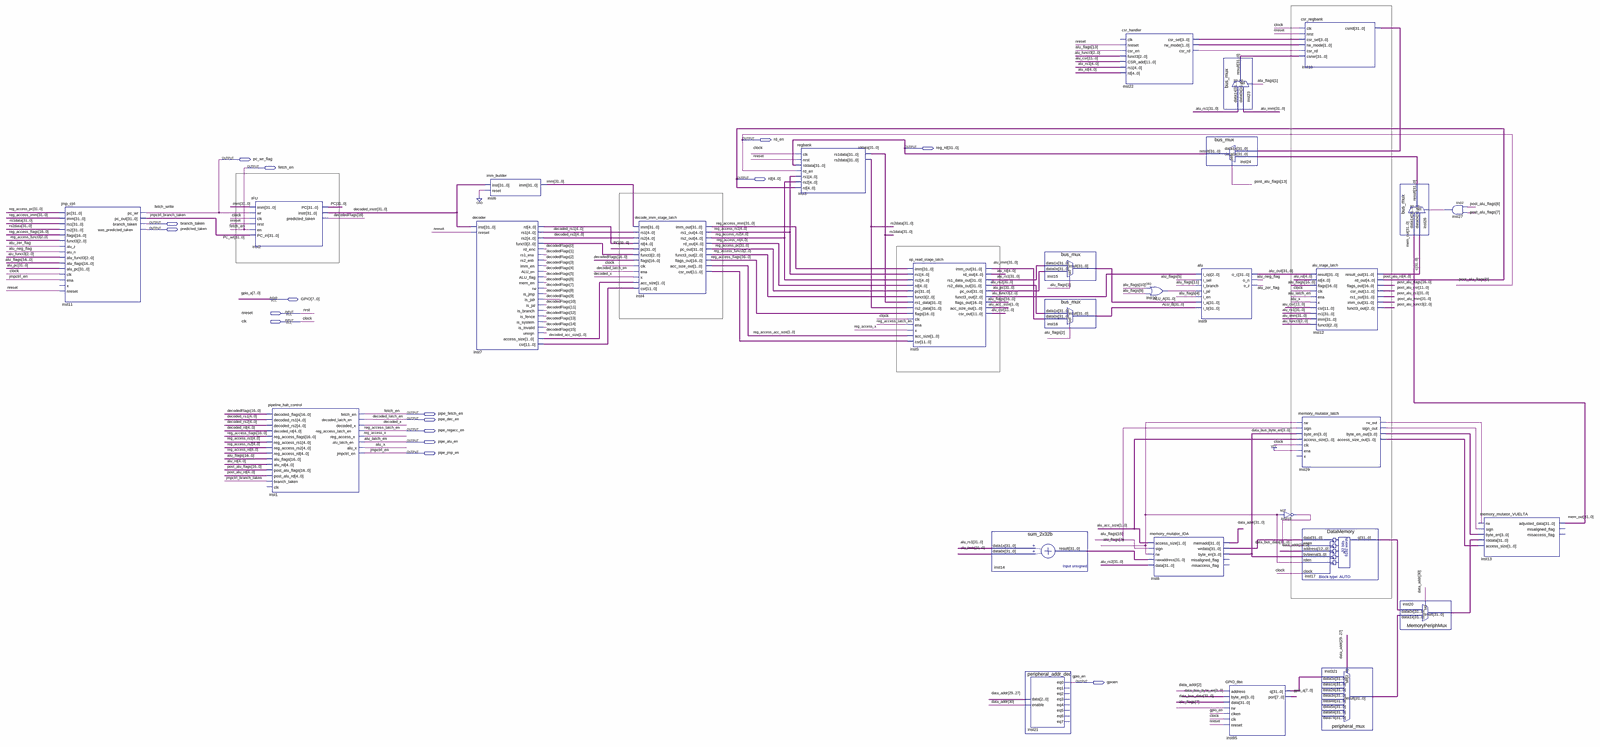
[diagram p0: schematic sheet, whole]
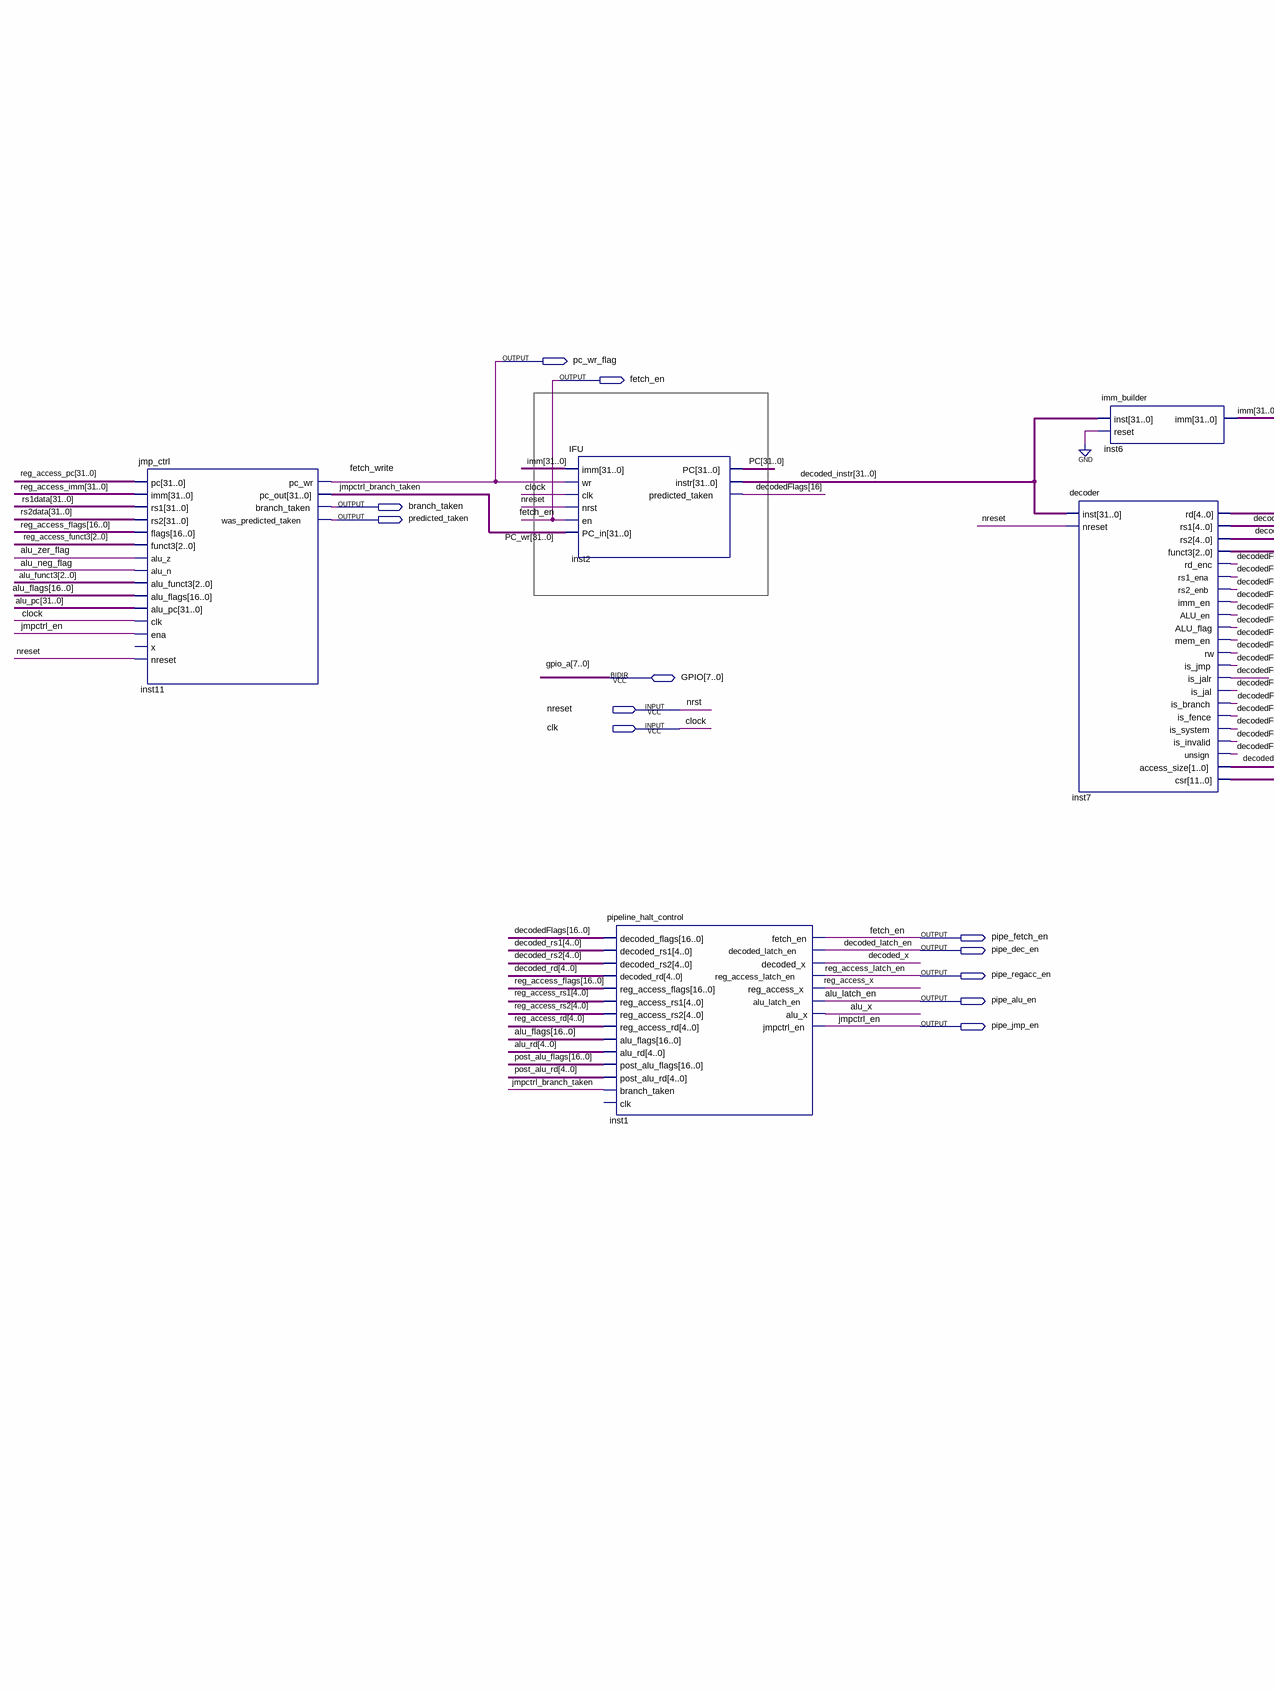
[diagram p1: schematic sheet, left part]
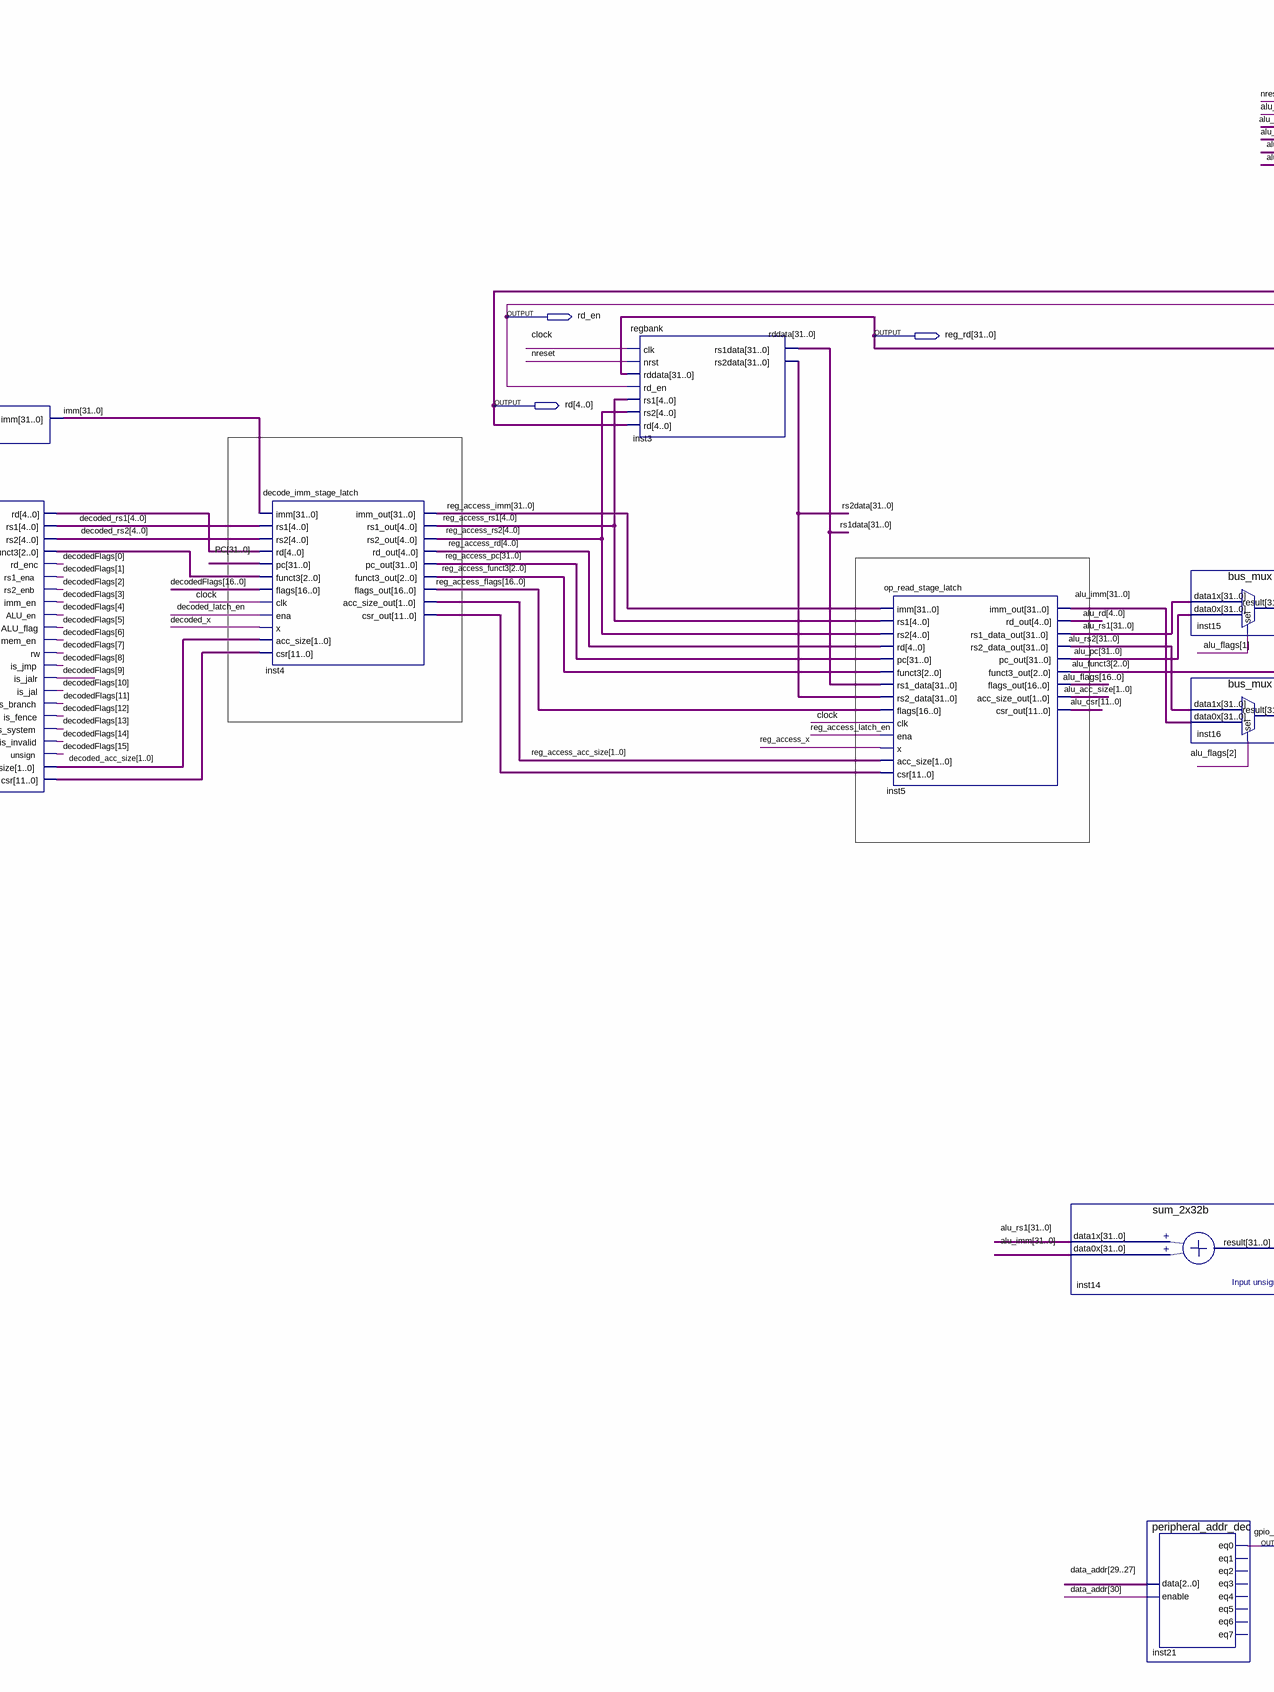
[diagram p2: schematic sheet, centre part]
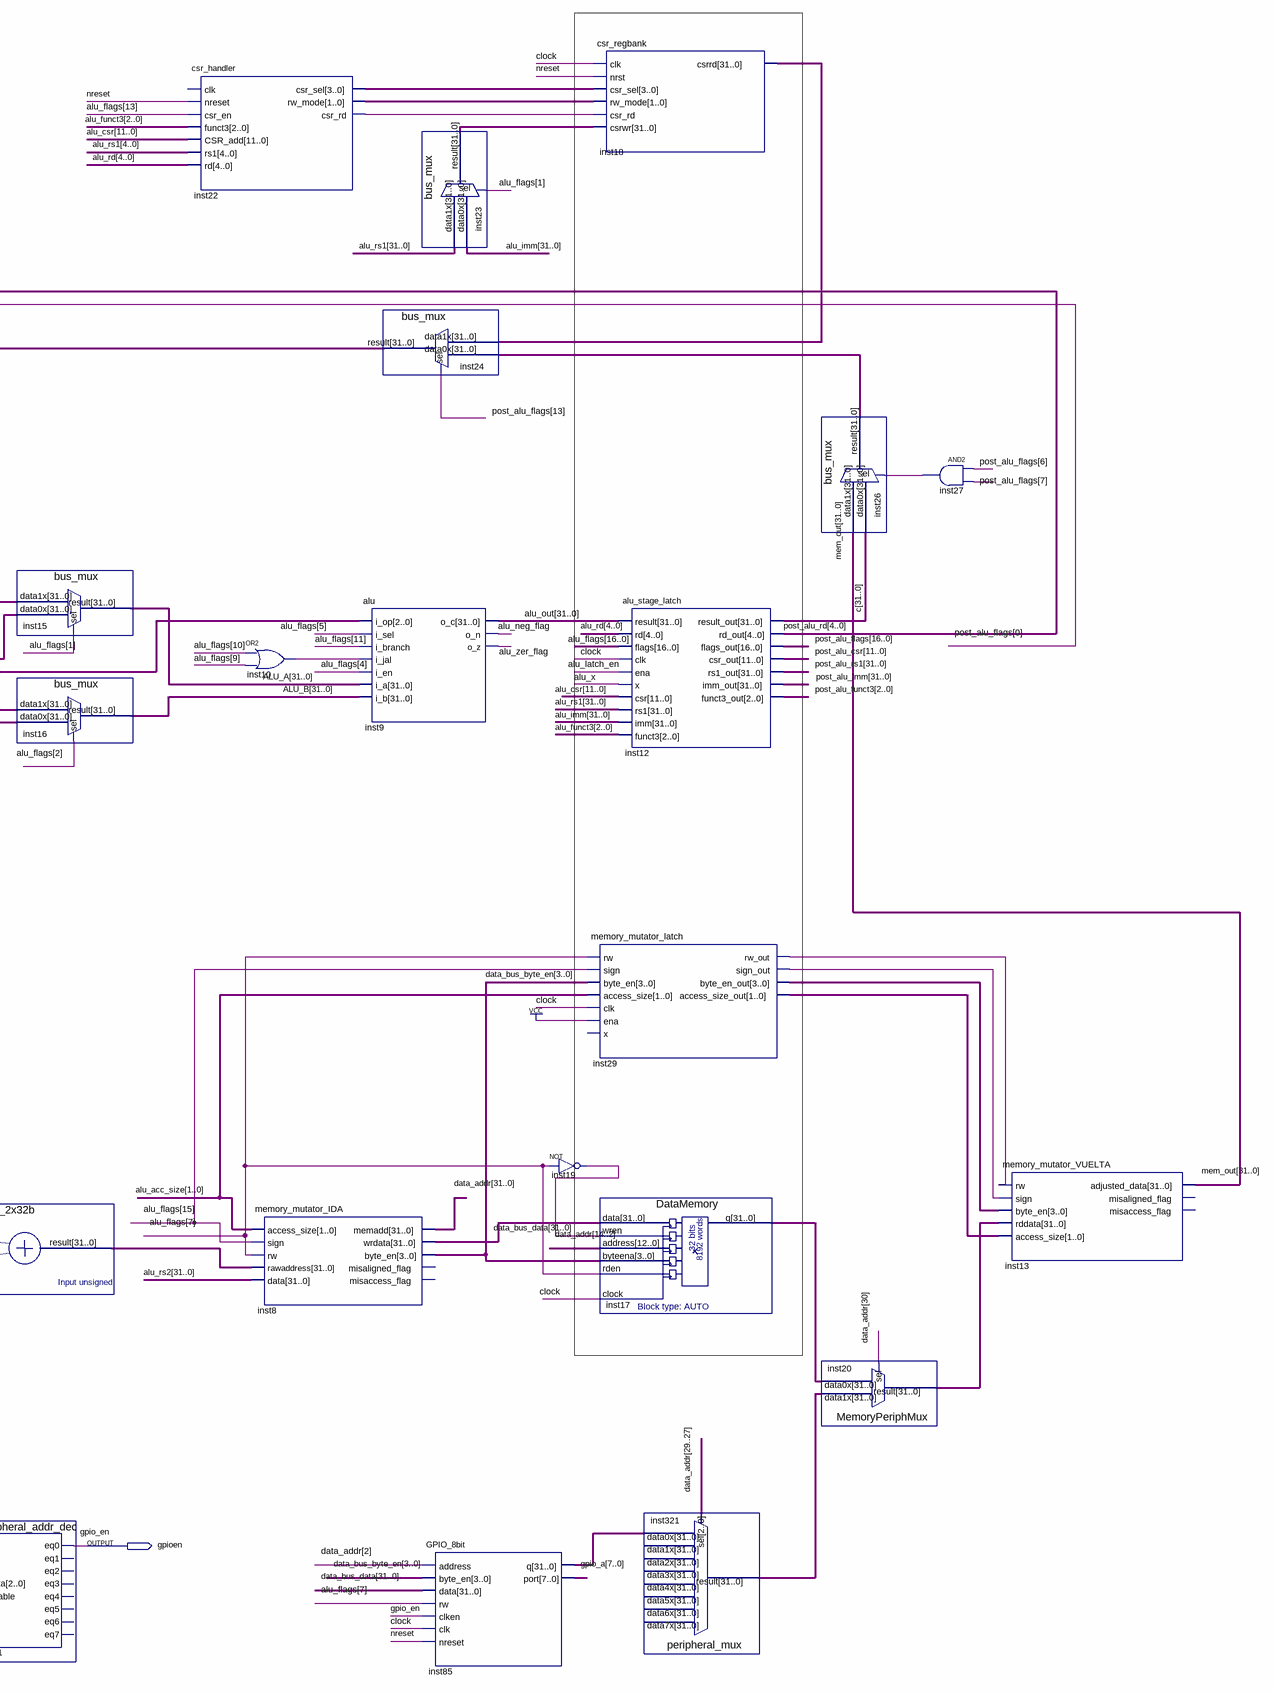
[diagram p3: schematic sheet, right part]
// Quartus schematic ERV24.bdf as structural Verilog: 29 symbols, 16 pins
module ERV24 (
  input  nreset,
  input  clk,
  inout  [7:0] GPIO,
  output rd_en,
  output [31:0] reg_rd,
  output pc_wr_flag,
  output fetch_en,
  output [4:0] rd,
  output branch_taken,
  output predicted_taken,
  output pipe_fetch_en,
  output pipe_dec_en,
  output pipe_regacc_en,
  output pipe_alu_en,
  output pipe_jmp_en,
  output gpioen
);

  wire alu_neg_flag, alu_x, alu_zer_flag, decoded_x, inst10_out, inst19_out, inst22_csr_rd, inst27_out,
       inst29_rw_out, inst29_sign_out, reg_access_x;
  wire [1:0] alu_acc_size, decoded_acc_size, inst22_rw_mode, inst29_access_size_out, reg_access_acc_size;
  wire [2:0] alu_funct3, inst7_funct3, post_alu_funct3, reg_access_funct3;
  wire [3:0] data_bus_byte_en, inst22_csr_sel, inst29_byte_en_out;
  wire [4:0] alu_rd, decoded_rd, decoded_rs1, decoded_rs2, inst7_rd, reg_access_rd, reg_access_rs1,
       reg_access_rs2;
  wire [11:0] alu_csr, inst4_csr_out, inst7_csr, post_alu_csr;
  wire [16:0] alu_flags, decodedFlags, reg_access_flags;
  wire [16:1] post_alu_flags;
  wire [31:0] ALU_A, ALU_B, alu_imm, alu_out, alu_pc, alu_rs1, alu_rs2, c, data_addr, data_bus_data,
       decoded_instr, imm, inst14_result, inst17_q, inst18_csrrd, inst20_result, inst23_result,
       inst26_result, inst85_q, inst321_result, mem_out, PC, PC_wr, post_alu_imm, post_alu_rs1,
       reg_access_imm, reg_access_pc, rs1data, rs2data;

  jmp_ctrl inst11 (
    .pc(reg_access_pc), .imm(reg_access_imm), .rs1(rs1data), .rs2(rs2data), .flags(reg_access_flags),
    .funct3(reg_access_funct3), .alu_z(alu_zer_flag), .alu_n(alu_neg_flag), .alu_funct3(alu_funct3),
    .alu_flags(alu_flags), .alu_pc(alu_pc), .clk(clk), .ena(pipe_jmp_en), .nreset(nreset),
    .pc_wr(pc_wr_flag), .pc_out(PC_wr), .branch_taken(branch_taken), .was_predicted_taken(predicted_taken));  // open: x
  IFU inst2 (
    .imm(imm), .wr(pc_wr_flag), .clk(clk), .nrst(nreset), .en(fetch_en), .PC_in(PC_wr), .PC(PC),
    .instr(decoded_instr), .predicted_taken(decodedFlags[16]));
  pipeline_halt_control inst1 (
    .decoded_flags(decodedFlags), .decoded_rs1(decoded_rs1), .decoded_rs2(decoded_rs2),
    .decoded_rd(decoded_rd), .reg_access_flags(reg_access_flags), .reg_access_rs1(reg_access_rs1),
    .reg_access_rs2(reg_access_rs2), .reg_access_rd(reg_access_rd), .alu_flags(alu_flags), .alu_rd(alu_rd),
    .post_alu_flags({post_alu_flags, rd_en}), .post_alu_rd(rd), .branch_taken(branch_taken),
    .fetch_en(fetch_en), .decoded_latch_en(pipe_dec_en), .decoded_x(decoded_x),
    .reg_access_latch_en(pipe_regacc_en), .reg_access_x(reg_access_x), .alu_latch_en(pipe_alu_en),
    .alu_x(alu_x), .jmpctrl_en(pipe_jmp_en));  // open: clk
  decoder inst7 (
    .inst(decoded_instr), .nreset(nreset), .rd(inst7_rd), .rs1(decoded_rs1), .rs2(decoded_rs2),
    .funct3(inst7_funct3), .rd_enc(decodedFlags[0]), .rs1_ena(decodedFlags[1]), .rs2_enb(decodedFlags[2]),
    .imm_en(decodedFlags[3]), .ALU_en(decodedFlags[4]), .ALU_flag(decodedFlags[5]), .mem_en(decodedFlags[6]),
    .rw(decodedFlags[7]), .is_jmp(decodedFlags[8]), .is_jalr(decodedFlags[9]), .is_jal(decodedFlags[10]),
    .is_branch(decodedFlags[11]), .is_fence(decodedFlags[12]), .is_system(decodedFlags[13]),
    .is_invalid(decodedFlags[14]), .unsign(decodedFlags[15]), .access_size(decoded_acc_size), .csr(inst7_csr));
  imm_builder inst6 (.inst(decoded_instr), .reset(1'b0), .imm(imm));
  decode_imm_stage_latch inst4 (
    .imm(imm), .rs1(decoded_rs1), .rs2(decoded_rs2), .rd(inst7_rd), .pc(PC), .funct3(inst7_funct3),
    .flags(decodedFlags), .clk(clk), .ena(pipe_dec_en), .x(decoded_x), .acc_size(decoded_acc_size),
    .csr(inst7_csr), .imm_out(reg_access_imm), .rs1_out(reg_access_rs1), .rs2_out(reg_access_rs2),
    .rd_out(reg_access_rd), .pc_out(reg_access_pc), .funct3_out(reg_access_funct3),
    .flags_out(reg_access_flags), .acc_size_out(reg_access_acc_size), .csr_out(inst4_csr_out));
  regbank inst3 (
    .clk(clk), .nrst(nreset), .rddata(reg_rd), .rd_en(rd_en), .rs1(reg_access_rs1), .rs2(reg_access_rs2),
    .rd(rd), .rs1data(rs1data), .rs2data(rs2data));
  op_read_stage_latch inst5 (
    .imm(reg_access_imm), .rs1(reg_access_rs1), .rs2(reg_access_rs2), .rd(reg_access_rd), .pc(reg_access_pc),
    .funct3(reg_access_funct3), .rs1_data(rs1data), .rs2_data(rs2data), .flags(reg_access_flags), .clk(clk),
    .ena(pipe_regacc_en), .x(reg_access_x), .acc_size(reg_access_acc_size), .csr(inst4_csr_out),
    .imm_out(alu_imm), .rd_out(alu_rd), .rs1_data_out(alu_rs1), .rs2_data_out(alu_rs2), .pc_out(alu_pc),
    .funct3_out(alu_funct3), .flags_out(alu_flags), .acc_size_out(alu_acc_size), .csr_out(alu_csr));
  sum_2x32b inst14 (.data1x(alu_rs1), .data0x(alu_imm), .result(inst14_result));
  peripheral_addr_dec inst21 (
    .data(data_addr[29:27]), .enable(data_addr[30]), .eq0(gpioen));  // open: eq1, eq2, eq3, eq4, eq5, eq6, eq7
  bus_mux inst15 (.data1x(alu_rs1), .data0x(alu_pc), .sel(alu_flags[1]), .result(ALU_A));
  bus_mux inst16 (.data1x(alu_rs2), .data0x(alu_imm), .sel(alu_flags[2]), .result(ALU_B));
  csr_handler inst22 (
    .nreset(nreset), .csr_en(alu_flags[13]), .funct3(alu_funct3), .CSR_add(alu_csr), .rs1(alu_rs1[4:0]),
    .rd(alu_rd), .csr_sel(inst22_csr_sel), .rw_mode(inst22_rw_mode), .csr_rd(inst22_csr_rd));  // open: clk
  or inst10 (inst10_out, alu_flags[10], alu_flags[9]);
  memory_mutator_IDA inst8 (
    .access_size(alu_acc_size), .sign(alu_flags[15]), .rw(alu_flags[7]), .rawaddress(inst14_result),
    .data(alu_rs2), .memadd(data_addr), .wrdata(data_bus_data), .byte_en(data_bus_byte_en));  // open: misaligned_flag, misaccess_flag
  alu inst9 (
    .i_op(alu_funct3), .i_sel(alu_flags[5]), .i_branch(alu_flags[11]), .i_jal(inst10_out),
    .i_en(alu_flags[4]), .i_a(ALU_A), .i_b(ALU_B), .o_c(alu_out), .o_n(alu_neg_flag), .o_z(alu_zer_flag));
  bus_mux inst24 (.data1x(inst18_csrrd), .data0x(inst26_result), .sel(post_alu_flags[13]), .result(reg_rd));
  bus_mux inst23 (.data1x(alu_rs1), .data0x(alu_imm), .sel(alu_flags[1]), .result(inst23_result));
  GPIO_8bit inst85 (
    .address(data_addr[2]), .byte_en(data_bus_byte_en), .data(data_bus_data), .rw(alu_flags[7]),
    .clken(gpioen), .clk(clk), .nreset(nreset), .q(inst85_q), .port(GPIO));
  not inst19 (inst19_out, alu_flags[7]);
  csr_regbank inst18 (
    .clk(clk), .nrst(nreset), .csr_sel(inst22_csr_sel), .rw_mode(inst22_rw_mode), .csr_rd(inst22_csr_rd),
    .csrwr(inst23_result), .csrrd(inst18_csrrd));
  memory_mutator_latch inst29 (
    .rw(alu_flags[7]), .sign(alu_flags[15]), .byte_en(data_bus_byte_en), .access_size(alu_acc_size),
    .clk(clk), .ena(1'b1), .rw_out(inst29_rw_out), .sign_out(inst29_sign_out),
    .byte_en_out(inst29_byte_en_out), .access_size_out(inst29_access_size_out));  // open: x
  DataMemory inst17 (
    .data(data_bus_data), .wren(inst19_out), .address(data_addr[14:2]), .byteena(data_bus_byte_en),
    .rden(alu_flags[7]), .clock(clk), .q(inst17_q));
  alu_stage_latch inst12 (
    .result(alu_out), .rd(alu_rd), .flags(alu_flags), .clk(clk), .ena(pipe_alu_en), .x(alu_x), .csr(alu_csr),
    .rs1(alu_rs1), .imm(alu_imm), .funct3(alu_funct3), .result_out(c), .rd_out(rd),
    .flags_out({post_alu_flags, rd_en}), .csr_out(post_alu_csr), .rs1_out(post_alu_rs1),
    .imm_out(post_alu_imm), .funct3_out(post_alu_funct3));
  peripheral_mux inst321 (
    .data0x(inst85_q), .sel(data_addr[29:27]), .result(inst321_result));  // open: data7x, data6x, data5x, data4x, data3x, data2x, data1x
  bus_mux inst26 (.data1x(mem_out), .data0x(c), .sel(inst27_out), .result(inst26_result));
  MemoryPeriphMux inst20 (.data1x(inst321_result), .data0x(inst17_q), .sel(data_addr[30]), .result(inst20_result));
  and inst27 (inst27_out, post_alu_flags[6], post_alu_flags[7]);
  memory_mutator_VUELTA inst13 (
    .rw(inst29_rw_out), .sign(inst29_sign_out), .byte_en(inst29_byte_en_out), .rddata(inst20_result),
    .access_size(inst29_access_size_out), .adjusted_data(mem_out));  // open: misaligned_flag, misaccess_flag

  assign pipe_fetch_en = fetch_en;

  // Other names for the same wires on the sheet: alu_latch_en = pipe_alu_en; clock = clk;
  //   decoded_latch_en = pipe_dec_en; fetch_write = pc_wr_flag; gpio_a[7:0] = GPIO; gpio_en = gpioen;
  //   jmpctrl_branch_taken = branch_taken; jmpctrl_en = pipe_jmp_en; nrst = nreset; post_alu_rd[4:0] = rd;
  //   post_alu_flags[0] = rd_en; rddata[31:0] = reg_rd; reg_access_latch_en = pipe_regacc_en
endmodule
